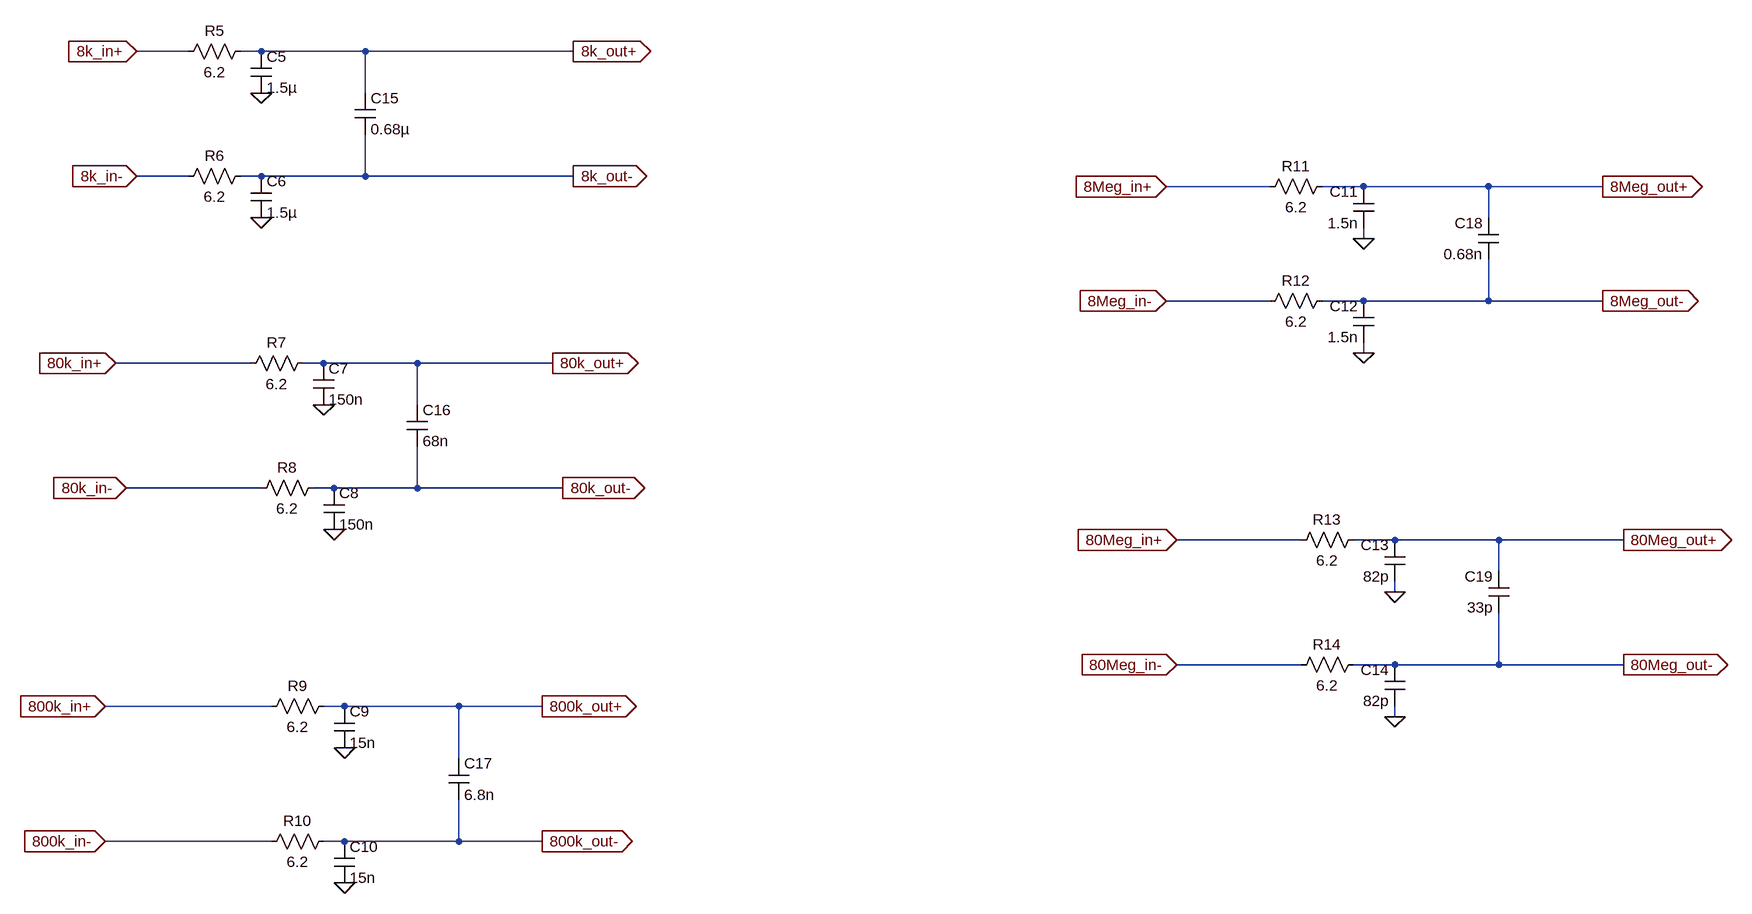
[diagram p0: schematic filters_diff.asc]
filters_diff.asc, the LTspice schematic file:
Version 4
SHEET 1 1940 1268
WIRE -688 -32 -768 -32
WIRE -576 -32 -608 -32
WIRE -416 -32 -576 -32
WIRE -96 -32 -416 -32
WIRE -416 32 -416 -32
WIRE -688 160 -768 160
WIRE -576 160 -608 160
WIRE -416 160 -416 96
WIRE -416 160 -576 160
WIRE -96 160 -416 160
WIRE 976 176 816 176
WIRE 1120 176 1056 176
WIRE 1312 176 1120 176
WIRE 1488 176 1312 176
WIRE 1312 224 1312 176
WIRE 1120 256 1120 240
WIRE 976 352 816 352
WIRE 1120 352 1056 352
WIRE 1312 352 1312 288
WIRE 1312 352 1120 352
WIRE 1488 352 1312 352
WIRE 1120 432 1120 416
WIRE -592 448 -800 448
WIRE -480 448 -512 448
WIRE -336 448 -480 448
WIRE -128 448 -336 448
WIRE -336 512 -336 448
WIRE -576 640 -784 640
WIRE -464 640 -496 640
WIRE -336 640 -336 576
WIRE -336 640 -464 640
WIRE -112 640 -336 640
WIRE 1024 720 832 720
WIRE 1168 720 1104 720
WIRE 1328 720 1168 720
WIRE 1520 720 1328 720
WIRE 1328 768 1328 720
WIRE 1168 800 1168 784
WIRE 1024 912 832 912
WIRE 1168 912 1104 912
WIRE 1328 912 1328 832
WIRE 1328 912 1168 912
WIRE 1520 912 1328 912
WIRE -560 976 -816 976
WIRE -448 976 -480 976
WIRE -272 976 -448 976
WIRE -144 976 -272 976
WIRE 1168 992 1168 976
WIRE -272 1056 -272 976
WIRE -560 1184 -816 1184
WIRE -448 1184 -480 1184
WIRE -272 1184 -272 1120
WIRE -272 1184 -448 1184
WIRE -144 1184 -272 1184
FLAG 1168 800 0
FLAG 832 720 80Meg_in+
IOPIN 832 720 In
FLAG 1520 720 80Meg_out+
IOPIN 1520 720 Out
FLAG -480 512 0
FLAG -800 448 80k_in+
IOPIN -800 448 In
FLAG -128 448 80k_out+
IOPIN -128 448 Out
FLAG 1120 432 0
FLAG 816 352 8Meg_in-
IOPIN 816 352 In
FLAG 1488 352 8Meg_out-
IOPIN 1488 352 Out
FLAG -448 1040 0
FLAG -144 976 800k_out+
IOPIN -144 976 Out
FLAG -576 32 0
FLAG -768 -32 8k_in+
IOPIN -768 -32 In
FLAG -96 -32 8k_out+
IOPIN -96 -32 Out
FLAG -816 976 800k_in+
IOPIN -816 976 In
FLAG -576 224 0
FLAG -768 160 8k_in-
IOPIN -768 160 In
FLAG -96 160 8k_out-
IOPIN -96 160 Out
FLAG 1120 256 0
FLAG 816 176 8Meg_in+
IOPIN 816 176 In
FLAG 1488 176 8Meg_out+
IOPIN 1488 176 Out
FLAG -464 704 0
FLAG -784 640 80k_in-
IOPIN -784 640 In
FLAG -112 640 80k_out-
IOPIN -112 640 Out
FLAG -448 1248 0
FLAG -144 1184 800k_out-
IOPIN -144 1184 Out
FLAG -816 1184 800k_in-
IOPIN -816 1184 In
FLAG 1168 992 0
FLAG 832 912 80Meg_in-
IOPIN 832 912 In
FLAG 1520 912 80Meg_out-
IOPIN 1520 912 Out
SYMBOL cap 1184 784 R180
WINDOW 0 24 56 Left 2
WINDOW 3 24 8 Left 2
SYMATTR InstName C13
SYMATTR Value 82p
SYMBOL res 1120 704 R90
WINDOW 0 0 56 VBottom 2
WINDOW 3 32 56 VTop 2
SYMATTR InstName R13
SYMATTR Value 6.2
SYMBOL res -496 432 R90
WINDOW 0 0 56 VBottom 2
WINDOW 3 32 56 VTop 2
SYMATTR InstName R7
SYMATTR Value 6.2
SYMBOL cap -496 448 R0
SYMATTR InstName C7
SYMATTR Value 150n
SYMBOL cap 1136 416 R180
WINDOW 0 24 56 Left 2
WINDOW 3 24 8 Left 2
SYMATTR InstName C12
SYMATTR Value 1.5n
SYMBOL res 1072 336 R90
WINDOW 0 0 56 VBottom 2
WINDOW 3 32 56 VTop 2
SYMATTR InstName R12
SYMATTR Value 6.2
SYMBOL res -464 960 R90
WINDOW 0 0 56 VBottom 2
WINDOW 3 32 56 VTop 2
SYMATTR InstName R9
SYMATTR Value 6.2
SYMBOL cap -464 976 R0
SYMATTR InstName C9
SYMATTR Value 15n
SYMBOL res -592 -48 R90
WINDOW 0 0 56 VBottom 2
WINDOW 3 32 56 VTop 2
SYMATTR InstName R5
SYMATTR Value 6.2
SYMBOL cap -592 -32 R0
SYMATTR InstName C5
SYMATTR Value 1.5µ
SYMBOL res -592 144 R90
WINDOW 0 0 56 VBottom 2
WINDOW 3 32 56 VTop 2
SYMATTR InstName R6
SYMATTR Value 6.2
SYMBOL cap -592 160 R0
SYMATTR InstName C6
SYMATTR Value 1.5µ
SYMBOL cap -432 32 R0
SYMATTR InstName C15
SYMATTR Value 0.68µ
SYMBOL cap 1136 240 R180
WINDOW 0 24 56 Left 2
WINDOW 3 24 8 Left 2
SYMATTR InstName C11
SYMATTR Value 1.5n
SYMBOL res 1072 160 R90
WINDOW 0 0 56 VBottom 2
WINDOW 3 32 56 VTop 2
SYMATTR InstName R11
SYMATTR Value 6.2
SYMBOL cap 1328 288 R180
WINDOW 0 24 56 Left 2
WINDOW 3 24 8 Left 2
SYMATTR InstName C18
SYMATTR Value 0.68n
SYMBOL res -480 624 R90
WINDOW 0 0 56 VBottom 2
WINDOW 3 32 56 VTop 2
SYMATTR InstName R8
SYMATTR Value 6.2
SYMBOL cap -480 640 R0
SYMATTR InstName C8
SYMATTR Value 150n
SYMBOL res -464 1168 R90
WINDOW 0 0 56 VBottom 2
WINDOW 3 32 56 VTop 2
SYMATTR InstName R10
SYMATTR Value 6.2
SYMBOL cap -464 1184 R0
SYMATTR InstName C10
SYMATTR Value 15n
SYMBOL cap 1184 976 R180
WINDOW 0 24 56 Left 2
WINDOW 3 24 8 Left 2
SYMATTR InstName C14
SYMATTR Value 82p
SYMBOL res 1120 896 R90
WINDOW 0 0 56 VBottom 2
WINDOW 3 32 56 VTop 2
SYMATTR InstName R14
SYMATTR Value 6.2
SYMBOL cap -352 512 R0
SYMATTR InstName C16
SYMATTR Value 68n
SYMBOL cap -288 1056 R0
SYMATTR InstName C17
SYMATTR Value 6.8n
SYMBOL cap 1344 832 R180
WINDOW 0 24 56 Left 2
WINDOW 3 24 8 Left 2
SYMATTR InstName C19
SYMATTR Value 33p

The netlist it stands for:
* filters_diff.asc
C13 0 80Meg_out+ 82p
R13 80Meg_out+ 80Meg_in+ 6.2
R7 80k_out+ 80k_in+ 6.2
C7 80k_out+ 0 150n
C12 0 8Meg_out- 1.5n
R12 8Meg_out- 8Meg_in- 6.2
R9 800k_out+ 800k_in+ 6.2
C9 800k_out+ 0 15n
R5 8k_out+ 8k_in+ 6.2
C5 8k_out+ 0 1.5µ
R6 8k_out- 8k_in- 6.2
C6 8k_out- 0 1.5µ
C15 8k_out+ 8k_out- 0.68µ
C11 0 8Meg_out+ 1.5n
R11 8Meg_out+ 8Meg_in+ 6.2
C18 8Meg_out- 8Meg_out+ 0.68n
R8 80k_out- 80k_in- 6.2
C8 80k_out- 0 150n
R10 800k_out- 800k_in- 6.2
C10 800k_out- 0 15n
C14 0 80Meg_out- 82p
R14 80Meg_out- 80Meg_in- 6.2
C16 80k_out+ 80k_out- 68n
C17 800k_out+ 800k_out- 6.8n
C19 80Meg_out- 80Meg_out+ 33p
.backanno
.end